# Altium schematic sheet pic.SchDoc
size A4; SheetNumber: 1; SheetTotal: 2
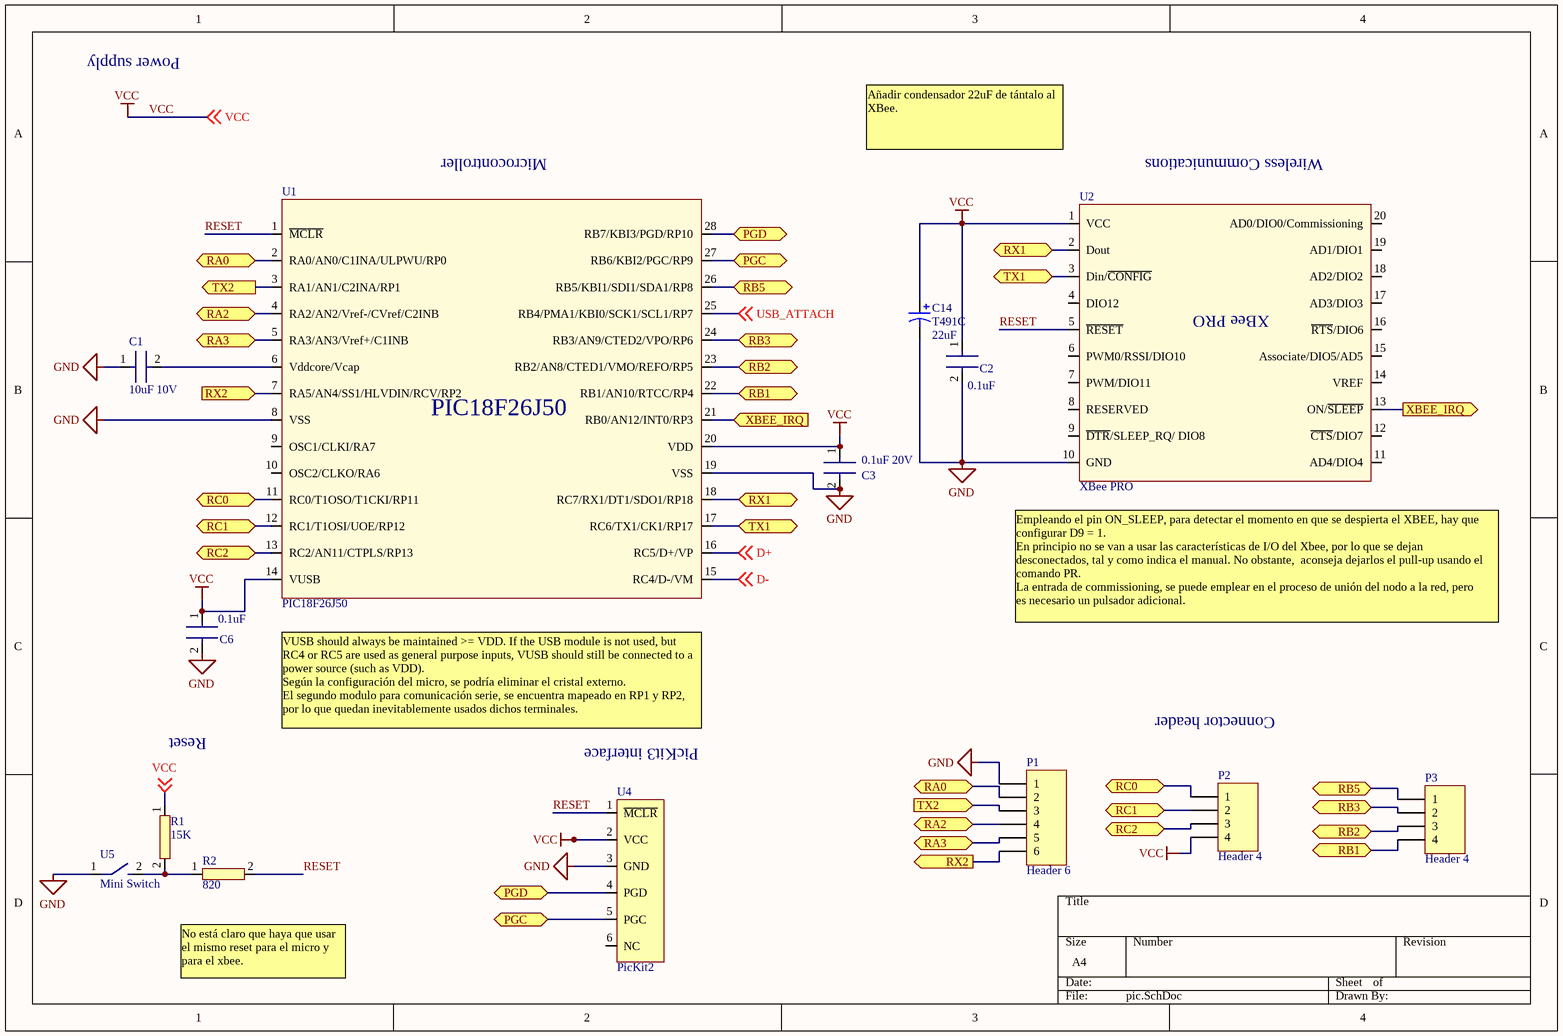
[diagram p0: pic.SchDoc]

## Parts
C1  10uF 10V  [C1206]
C2  0.1uF  [C1206]
C3  0.1uF 20V  [C1206]
C6  0.1uF  [C1206]
C14  T491C  value 22uF  [C]
P1  Header 6  [HDR1X6]
P2  Header 4  [HDR1X4]
P3  Header 4  [HDR1X4]
R1  15K  [3216[1206]]
R2  820  [3216[1206]]
U1  PIC18F26J50  [PIC18F-SOIC]
U2  XBee PRO  [XBee PRO]
U4  PicKit2  [PICKIT3]
U5  Mini Switch  [Mini Switch]

## Ports
PGC, PGD, RA0 (bidir), RA2 (bidir), RA3 (bidir), RB1 (bidir), RB2 (bidir), RB3 (bidir), RB5 (bidir), RC0 (bidir), RC1 (bidir), RC2 (bidir), RX1, RX2 (in), RX2 (out), TX1, TX2 (in), TX2 (out), XBEE_IRQ (in), XBEE_IRQ (out)

## Nets
GND: C1.1 C2.2 C3.2 C6.2 C14.2 P1.1 U1.8(VSS) U1.19(VSS) U2.10(GND) U4.3(GND) U5.1
VCC: C2.1 C3.1 C6.1 C14.1 P2.4 R1.1 U1.14(VUSB) U1.20(VDD) U2.1(VCC) U4.2(VCC) ; off-sheet VCC
D+: U1.16(RC5/D+/VP) ; off-sheet D+
D-: U1.15(RC4/D-/VM) ; off-sheet D-
PGC: U1.27(RB6/KBI2/PGC/RP9) U4.5(PGC) ; port PGC
PGD: U1.28(RB7/KBI3/PGD/RP10) U4.4(PGD) ; port PGD
RA0: P1.2 U1.2(RA0/AN0/C1INA/ULPWU/RP0) ; port RA0
RA2: P1.4 U1.4(RA2/AN2/Vref-/CVref/C2INB) ; port RA2
RA3: P1.5 U1.5(RA3/AN3/Vref+/C1INB) ; port RA3
RB1: P3.4 U1.22(RB1/AN10/RTCC/RP4) ; port RB1
RB2: P3.3 U1.23(RB2/AN8/CTED1/VMO/REFO/RP5) ; port RB2
RB3: P3.2 U1.24(RB3/AN9/CTED2/VPO/RP6) ; port RB3
RB5: P3.1 U1.26(RB5/KBI1/SDI1/SDA1/RP8) ; port RB5
RC0: P2.1 U1.11(RC0/T1OSO/T1CKI/RP11) ; port RC0
RC1: P2.2 U1.12(RC1/T1OSI/UOE/RP12) ; port RC1
RC2: P2.3 U1.13(RC2/AN11/CTPLS/RP13) ; port RC2
RESET: R2.2 U1.1(~{MCLR}) U2.5(~{RESET}) U4.1(~{MCLR})
RX1: U1.18(RC7/RX1/DT1/SDO1/RP18) U2.2(Dout) ; port RX1
RX2: P1.6 U1.7(RA5/AN4/SS1/HLVDIN/RCV/RP2) ; port RX2
TX1: U1.17(RC6/TX1/CK1/RP17) U2.3(Din/~{CONFIG}) ; port TX1
TX2: P1.3 U1.3(RA1/AN1/C2INA/RP1) ; port TX2
USB_ATTACH: U1.25(RB4/PMA1/KBI0/SCK1/SCL1/RP7) ; off-sheet USB_ATTACH
XBEE_IRQ: U1.21(RB0/AN12/INT0/RP3) U2.13(ON/~{SLEEP}) ; port XBEE_IRQ
NetC1_2: C1.2 U1.6(Vddcore/Vcap)
NetR1_2: R1.2 R2.1 U5.2

Not connected (* = marked no-connect by the designer): U1 9(OSC1/CLKI/RA7) 10(OSC2/CLKO/RA6); U2 4(DIO12) 6(PWM0/RSSI/DIO10) 7(PWM/DIO11) 8(RESERVED) 9(~{DTR}/SLEEP_RQ/_DIO8) 11(AD4/DIO4) 12(~{CTS}/DIO7) 14(VREF) 15(Associate/DIO5/AD5) 16(~{RTS}/DIO6) 17(AD3/DIO3) 18(AD2/DIO2) 19(AD1/DIO1) 20(AD0/DIO0/Commissioning); U4 6(NC)

## Notes on the sheet
- Power supply
- Microcontroller
- Añadir condensador 22uF de tántalo al XBee.
- (near U2) Wireless Communications
- (near U2) Empleando el pin ON_SLEEP, para detectar el momento en que se despierta el XBEE, hay que configurar D9 = 1.
  En principio no se van a usar las características de I/O del Xbee, por lo que se dejan desconectados, tal y como indica el manual. No obstante,  aconseja dejarlos el pull-up usando el comando PR.
  La entrada de commissioning, se puede emplear en el proceso de unión del nodo a la red, pero
  es necesario un pulsador adicional.
- Connector header
- Reset
- VUSB should always be maintained >= VDD. If the USB module is not used, but RC4 or RC5 are used as general purpose inputs, VUSB should still be connected to a power source (such as VDD).
  Según la configuración del micro, se podría eliminar el cristal externo.
  El segundo modulo para comunicación serie, se encuentra mapeado en RP1 y RP2, por lo que quedan inevitablemente usados dichos terminales.
- (near U4) PicKit3 interface
- No está claro que haya que usar el mismo reset para el micro y para el xbee.

## Library data of the parts
C1-C3 C6 = TDK C3216X7R1C106K
  C2: Value: 0.1uF
C14 = T491C: Solid Tantalum Chip Capacitor, Standard T491 Series - Industrial Grade; Published: 17-Jul-2002; LatestRevisionDate: 19-Mar-2004; LatestRevisionNote: Silkscreen dimensions re-sized.; DatasheetDocument: Mar-2001; PackageDocument: Mar-2001; PackageReference: C; Publisher: Altium Limited; Code_JEITA: 6032-28; ComponentLink1Description: Manufacturer Link; ComponentLink1URL: http://www.kemet.com/; ComponentLink2Description: Datasheet; ComponentLink2URL: http://www.kemet.com/kemet/web/homepage/kechome.nsf/vapubfilesname/F3102TA.pdf/$file/F3102TA.pdf
P1 = Header 6: Header, 6-Pin; LatestRevisionDate: 17-Jul-2002; LatestRevisionNote: Re-released for DXP Platform.; Publisher: Altium Limited
P2 P3 = Header 4: Header, 4-Pin; LatestRevisionDate: 17-Jul-2002; LatestRevisionNote: Re-released for DXP Platform.; Publisher: Altium Limited
R1 R2 = RES 1206